# Altium project NESL_Underwater_Sensor_Tag.PrjPcb
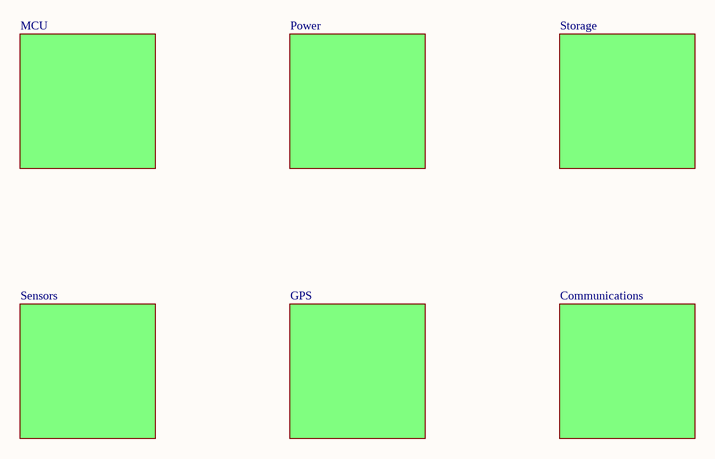
[diagram p0: Layout.SchDoc]
7 sheets, 67 parts. Net scope: flat (ports and power ports of the same name join across sheets).
Board file: PCB.PcbDoc
Sheets:
  Layout.SchDoc
    MCU = MCU.SchDoc
    Designator = Power.SchDoc
    Designator = Sensors.SchDoc
    Designator = Storage.SchDoc
    Designator = GPS.SchDoc
    Designator = Communications.SchDoc

## Sheet Layout.SchDoc
size A; SheetNumber: 1; SheetTotal: 6

### Sub-sheets
Designator = Power: no entries
Designator = Sensors: no entries
Designator = Storage: no entries
Designator = GPS: no entries
Designator = Communications: no entries
MCU = MCU: no entries

## Sheet MCU.SchDoc
size A; SheetNumber: 2; SheetTotal: 7
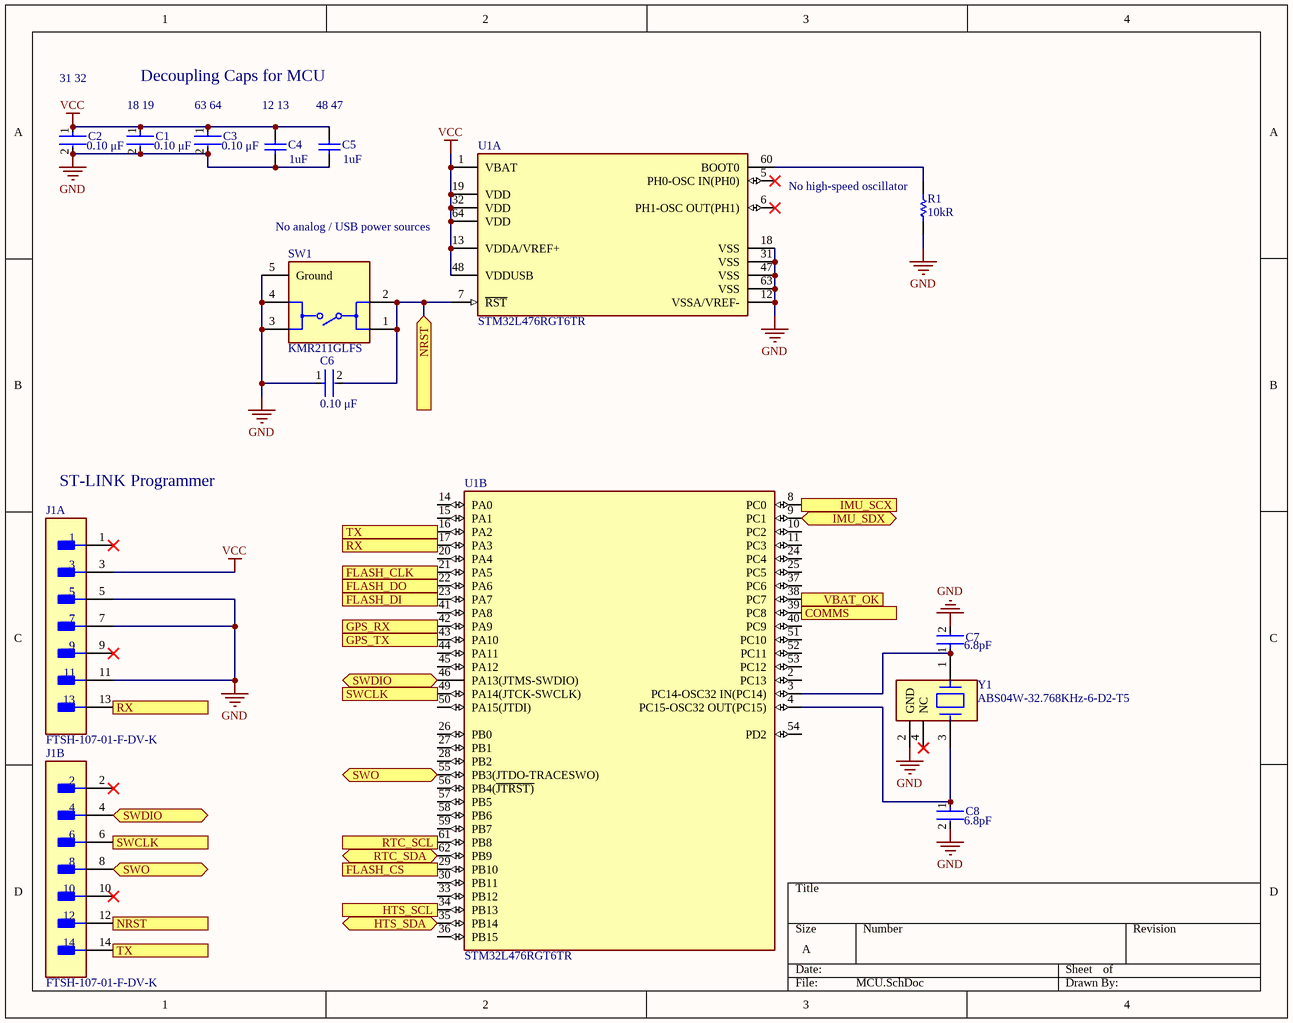
[diagram p1: MCU.SchDoc]

### Parts
C1  Capacitance: 0.10 μF  [FP-C0603C-CF-MFG]  (hidden comment: C0603C104K5RACTU)
C2  Capacitance: 0.10 μF  [FP-C0603C-CF-MFG]  (hidden comment: C0603C104K5RACTU)
C3  Capacitance: 0.10 μF  [FP-C0603C-CF-MFG]  (hidden comment: C0603C104K5RACTU)
C4  Capacitance: 1uF  [CAPC2013X135X45LL10T25]  (hidden comment: GRM21BR71H105KA12L)
C5  Capacitance: 1uF  [CAPC2013X135X45LL10T25]  (hidden comment: GRM21BR71H105KA12L)
C6  Capacitance: 0.10 μF  [FP-C0603C-CF-MFG]  (hidden comment: C0603C104K5RACTU)
C7  Capacitance: 6.8pF  [FP-0805-L_2_01_0_2-W_1_25-MFG]  (hidden comment: 08051A6R8CAT2A)
C8  Capacitance: 6.8pF  [FP-0805-L_2_01_0_2-W_1_25-MFG]  (hidden comment: 08051A6R8CAT2A)
J1  FTSH-107-01-F-DV-K  [FP-FTSH-107-01-F-DV-K-MFG]  (parts A,B of 2)
R1  Resistor: 10kR  [RESC2013X60X35NL10T20]  (hidden comment: RC0805FR-0710KL)
SW1  KMR211GLFS  [FP-KMR211GLFS-MFG]
U1  STM32L476RGT6TR  [FP-LQFP64-5W-MFG]  (parts A,B of 2)
Y1  ABS04W-32.768KHz-6-D2-T5  [FP-ABS04W-MFG]

### Ports
COMMS (out), FLASH_CLK (out), FLASH_CS (out), FLASH_DI (out), FLASH_DO (in), GPS_RX (out), GPS_TX (in), HTS_SCL (out), HTS_SDA (bidir), IMU_SCX (out), IMU_SDX (bidir), NRST (in), NRST (out), RTC_SCL (out), RTC_SDA (bidir), RX (in), RX (out), SWCLK (in), SWCLK (out), SWDIO (bidir), SWO (bidir), TX (in), TX (out), VBAT_OK

### Nets
GND: C1.2 C2.2 C3.2 C4.1 C5.1 C6.1 C7.2 C8.2 J1.5 J1.7 J1.11 R1.1 SW1.3 SW1.4 SW1.5(Ground) U1.12(VSSA/VREF-) U1.18(VSS) U1.31(VSS) U1.47(VSS) U1.63(VSS) Y1.2(GND)
VCC: C1.1 C2.1 C3.1 C4.2 C5.2 J1.3 U1.1(VBAT) U1.13(VDDA/VREF+) U1.19(VDD) U1.32(VDD) U1.48(VDDUSB) U1.64(VDD)
NetC6_2: C6.2 J1.12 SW1.1 SW1.2 U1.7(~{RST}) ; port NRST
NetC7_1: C7.1 U1.3(PC14-OSC32_IN(PC14)) Y1.1
NetC8_1: C8.1 U1.4(PC15-OSC32_OUT(PC15)) Y1.3
NetJ1_4: J1.4 U1.46(PA13(JTMS-SWDIO)) ; port SWDIO
NetJ1_6: J1.6 U1.49(PA14(JTCK-SWCLK)) ; port SWCLK
NetJ1_8: J1.8 U1.55(PB3(JTDO-TRACESWO)) ; port SWO
NetJ1_13: J1.13 U1.17(PA3) ; port RX
NetJ1_14: J1.14 U1.16(PA2) ; port TX
NetR1_2: R1.2 U1.60(BOOT0)
NetR2_1: U1.9(PC1) ; port IMU_SDX
NetR3_1: U1.34(PB13) ; port HTS_SCL
NetR4_1: U1.35(PB14) ; port HTS_SDA
NetR5_1: U1.8(PC0) ; port IMU_SCX
NetR6_1: U1.61(PB8) ; port RTC_SCL
NetR11_1: U1.39(PC8) ; port COMMS
NetU1_21: U1.21(PA5) ; port FLASH_CLK
NetU1_22: U1.22(PA6) ; port FLASH_DO
NetU1_23: U1.23(PA7) ; port FLASH_DI
NetU1_29: U1.29(PB10) ; port FLASH_CS
NetU1_38: U1.38(PC7) ; port VBAT_OK
NetU1_42: U1.42(PA9) ; port GPS_RX
NetU1_43: U1.43(PA10) ; port GPS_TX
NetU1_62: U1.62(PB9) ; port RTC_SDA

Not connected (* = marked no-connect by the designer): J1 1* 2* 9* 10*; U1 2(PC13) 5(PH0-OSC_IN(PH0))* 6(PH1-OSC_OUT(PH1))* 10(PC2) 11(PC3) 14(PA0) 15(PA1) 20(PA4) 24(PC4) 25(PC5) 26(PB0) 27(PB1) 28(PB2) 30(PB11) 33(PB12) 36(PB15) 37(PC6) 40(PC9) 41(PA8) 44(PA11) 45(PA12) 50(PA15(JTDI)) 51(PC10) 52(PC11) 53(PC12) 54(PD2) 56(PB4(~{JTRST)}) 57(PB5) 58(PB6) 59(PB7); Y1 4(NC)*

### Notes on the sheet
- 31 32
- Decoupling Caps for MCU
- (near C1) 18 19
- (near C3) 63 64
- (near C4) 12 13
- (near C5) 48 47
- No analog / USB power sources
- (near R1) No high-speed oscillator
- ST-LINK Programmer

### Library data of the parts
C1-C3 C6 = CMP-2006-03061-2: CAP CER 0.1UF 50V X7R 0603; Manufacturer: KEMET; Tolerance: 0.1; Temperature Coefficient: 30ppm/°C; Material: Ceramic; Automotive Grade: Grade 1; Value: 0.10 μF; Temperature: -55°C to +125°C; RoHS: TRUE; Temperature Range High: +125°C; Lead Free: Yes; Octopart: https://octopart.com/c0603c104k5ractu-kemet-139244; Digikey Description: CAP CER 0.1UF 50V X7R 0603; Category: Cap; Package: C0603C-CF; ComponentLink2Description: Datasheet; Temperature Range Low: -55°C; Device Class L1: Passive Components; Voltage Rating: 50 V; Automotive: Yes; Device Class L3: Ceramic Capacitors; ComponentLink2URL: https://api.kemet.com/component-edge/download/datasheet/C0603C100J5GACAUTO.pdf; Device Class L2: Capacitors; Manufacturer Part Number: C0603C104K5RACTU; Temperature Characteristic: X7R; Height: 0.87mm
C4 C5 = CMP-1036-04761-2: Manufacturer: Murata; Part Number: GRM21BR71H105KA12L
C7 C8 = CMP-1036-00709-3: General Purpose Ceramic Capacitor, 0805, 6.8pF, 0.25pF, C0G, 30ppm/°C, 100V; Dissipation Factor: 10%; Insulation Resistance: 100GR; Tolerance: 5%; Max Operating Temperature: 125°C; RoHS Compliant: Yes; Termination: SMD/SMT; Number of Pins: 2; Packaging: Tape and Reel; Mount: Surface Mount; Case Code (Metric): 2012; Case Code (Imperial): 0805; Height: 0.71mm; Min Operating Temperature: -55°C; Width: 0.049inch; Temperature Coefficient: 0ppm/°C; Length: 2.01mm; Dielectric: C0G; Series: -; Voltage Rating (DC): 100V; Dielectric Material: Ceramic; Depth: 1.25mm; Contact Plating: Tin; Voltage Rating: 100V; Thickness: 0.037inch; Case/Package: 0805; Lead Free: Lead Free; Radiation Hardening: No; Voltage: 100V; Construction: Flat; Package Quantity: 1; REACH SVHC: No SVHC
J1 = CMP-02766-001448-1: CONN HEADER SMD 14POS 1.27MM; Gender: Male; Connector Type: Male Pin; Number of Contacts: 14; Row Spacing: 0.05inch; Min Operating Temperature: -55°C; Package Quantity: 1; Lead Free: Lead Free; RoHS Compliant: Yes; Contact Material: Bronze; Contact Plating: Gold; Number of Rows: 2; Housing Material: Polymer; Contact Type: Male Pin; Series: FTSH; Max Operating Temperature: 125°C; Orientation: Straight; Number of Positions: 14; Pitch: 1.27mm; Housing Color: Black; Color: Black; Radiation Hardening: No; Length: 8.89mm; Termination: Solder; Packaging: Rail/Tube; Depth: 5.84mm; Mount: Surface Mount; Contact Mating Length: 0.12inch
R1 = CMP-1659-00013-4: Chip Resistor, 10 KOhm, +/- 1%, 0.125 W, -55 to 155 degC, 0805 (2012 Metric), RoHS, Tape and Reel; Manufacturer: Yageo; Voltage Rating: 150 V; Mount: Surface Mount; ComponentLink1Description: Manufacturer URL; ComponentLink2URL: http://www.yageo.com/documents/recent/PYu-RC_Group_51_RoHS_L_04.pdf; Pins: 2; Length: 2 mm; Min Operating Temperature: -55 degC; Height: 0.5 mm; Mounting Technology: Surface Mount; RoHSCompliant: true; REACH SVHC: No SVHC; ComponentLink1URL: http://www.yageo.com/; Max Operating Temperature: 155 degC; PackageReference: 0805; DatasheetVersion: Rev. 4, 02/2016; Package Quantity: 5000; Packaging: Tape and Reel; ComponentLink2Description: Datasheet; PackageDescription: 2-Pin Surface Mounted Device, Body 2 x 1.25 mm
SW1 = CMP-10040-000023-1: SWITCH TACTILE SPST-NO 0.05A 32V; Switch Function: Off-Mom; Throw Configuration: SPST; Switch Travel: 0.2mm; Current Rating: 50mA; Illumination Type: Non-Illuminated; Actuator Length: 0.5mm; Power Rating: 1W; Operating Force: 1.2N; Actuator Type: Standard; Mechanical Life: 200000Cycles; REACH SVHC: No SVHC; Voltage Rating (DC): 32V; Length: 2.8mm; Min Operating Temperature: -40°C; Mount: Surface Mount; Max Voltage Rating (DC): 32V; Width: 2.8mm; Depth: 4.6mm; Packaging: Tape and Reel; Lead Free: Lead Free; Contact Material: Silver; Termination: Gull Wing; Package Quantity: 1; Contact Current Rating: 50mA; Orientation: Straight; Max Operating Temperature: 85°C; Radiation Hardening: No; Max Current Rating: 50mA; Contact Plating: Silver
U1 = CMP-12105-000039-1: IC MCU 32BIT 1MB FLASH 64LQFP; Manufacturer: STMicroelectronics; Number Of Timers/Counters: 13; Number Of Spi Channels: 3; Number Of Pwm Channels: 28; Number Of Usb Channels: 1; Frequency: 80MHz; Data Bus Width: 32bits; Max Supply Voltage: 3.6V; Ram Size: 128KBytes; Memory Size: 1MBytes; Number Of Uart Channels: 6; Number Of Adc Channels: 16; Core Architecture: ARM Cortex-M4; Standoff Height: 0.05mm; Interface: I2C,SPI,UART,USART,CAN,USB,LIN,IrDA,SMBus,Other; Max Junction Temp: +105°C; Min Supply Voltage: 1.71V; Number Of I/Os: 51; Temperature Range Low: -40°C; Automotive: No; Ambient Temperature Range Low: -40°C; ComponentLink2URL: https://www.st.com/content/ccc/resource/technical/document/datasheet/c5/ed/2f/60/aa/79/42/0b/DM00108832.pdf/files/DM00108832.pdf/jcr:content/translations/en.DM00108832.pdf; Temperature: -40°C to +105°C; Device Class L1: Integrated Circuits (ICs); Package: LQFP64-5W; Category: IC; Memory Type: FLASH; Digikey Description: IC MCU 32BIT 1MB FLASH 64LQFP; Number Of A/D Converters: 3; Number Of I2C Channels: 3; Temperature Range High: +105°C; Lead Free: Yes; Number Of Cores: 1; Height: 1.6mm; Ambient Temperature Range High: +85°C; Device Class L2: Embedded Processors and Controllers; Octopart: https://octopart.com/stm32l476rgt6tr-stmicroelectronics-74146120; RoHS: TRUE; Ipc Land Pattern Name: QFP50P1200X1200X160-64; Mouser Description: MCU 32-Bit STM32 ARM Cortex M4 RISC 1MB Flash 1.8V/2.5V/3.3V 64-Pin LQFP T/R; ComponentLink2Description: Datasheet; Manufacturer Part Number: STM32L476RGT6TR; Device Class L3: Microcontrollers
Y1 = CMP-27762-001949-1: CRYSTAL 32.7680KHZ 4PF SMD; RoHS Compliant: Yes

## Sheet Power.SchDoc
size A; SheetNumber: 6; SheetTotal: 7
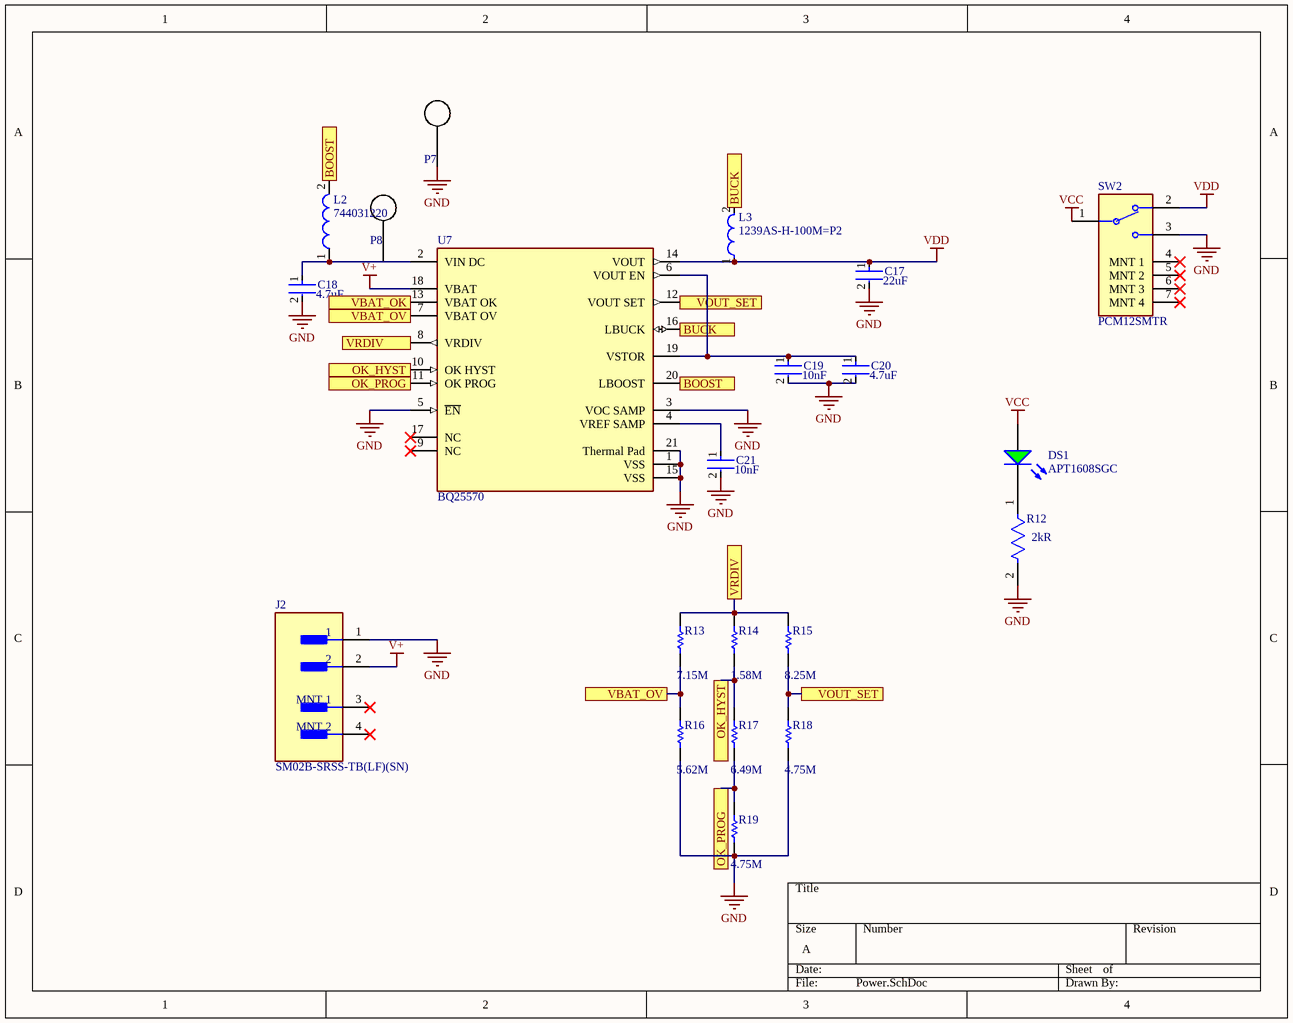
[diagram p2: Power.SchDoc]

### Parts
C17  Capacitance: 22uF  [FP-GRM21B-0_15-MFG]  (hidden comment: GRM21BR60J226ME39L)
C18  Capacitance: 4.7uF  [FP-C0603-CG-MFG]  (hidden comment: C0603C475K9PACTU)
C19  Capacitance: 10nF  [FP-C0805C-DN-MFG]  (hidden comment: C0805C103K2RACTU)
C20  Capacitance: 4.7uF  [FP-C0603-CG-MFG]  (hidden comment: C0603C475K9PACTU)
C21  Capacitance: 10nF  [FP-C0805C-DN-MFG]  (hidden comment: C0805C103K2RACTU)
DS1  APT1608SGC  [KING-APT1608SGC_V]
J2  SM02B-SRSS-TB(LF)(SN)  [FP-SM02B-SRSS-TB_LF_SN-0]
L2  744031220  [WE-TPC-3816-S]
L3  1239AS-H-100M=P2  [FP-DFE252012C-MFG]
P7  BlankPad  [BlankPad]  (value not drawn)
P8  BlankPad  [BlankPad]  (value not drawn)
R12  Resistance: 2kR  [FP-CRCW0805-e3-IPC_B]  (hidden comment: CRCW08052K00FKEA)
R13  Parameter 1: 7.15M  [RESC2013X50X30LL20T20]  (hidden comment: CRCW0805100RFKEA)
R14  Parameter 1: 1.58M  [RESC2013X50X30LL20T20]  (hidden comment: CRCW0805100RFKEA)
R15  Parameter 1: 8.25M  [RESC2013X50X30LL20T20]  (hidden comment: CRCW0805100RFKEA)
R16  Parameter 1: 5.62M  [RESC2013X50X30LL20T20]  (hidden comment: CRCW0805100RFKEA)
R17  Parameter 1: 6.49M  [RESC2013X50X30LL20T20]  (hidden comment: CRCW0805100RFKEA)
R18  Parameter 1: 4.75M  [RESC2013X50X30LL20T20]  (hidden comment: CRCW0805100RFKEA)
R19  Parameter 1: 4.75M  [RESC2013X50X30LL20T20]  (hidden comment: CRCW0805100RFKEA)
SW2  PCM12SMTR  [FP-PCM12SMTR-MFG]
U7  BQ25570  [FP-RGR0020A-MFG]

### Ports
BOOST, BUCK, OK_HYST, OK_PROG, VBAT_OK, VBAT_OV, VOUT_SET, VRDIV

### Nets
GND: C17.2 C18.2 C19.2 C20.2 C21.2 J2.1 R12.2 R16.1 R18.1 R19.1 SW2.3 U7.1(VSS) U7.3(VOC_SAMP) U7.5(~{EN}) U7.15(VSS) U7.21(Thermal_Pad)
V+: J2.2 U7.18(VBAT)
VCC: DS1.1(A) SW2.1
VDD: C17.1 L3.1 SW2.2 U7.14(VOUT)
NetC18_1: C18.1 L2.1 U7.2(VIN_DC)
NetC19_1: C19.1 C20.1 U7.6(VOUT_EN) U7.19(VSTOR)
NetC21_1: C21.1 U7.4(VREF_SAMP)
NetDS1_2: DS1.2(K) R12.1
NetL2_2: L2.2 U7.20(LBOOST) ; port BOOST
NetL3_2: L3.2 U7.16(LBUCK) ; port BUCK
NetR13_1: R13.1 R16.2 U7.7(VBAT_OV) ; port VBAT_OV
NetR13_2: R13.2 R14.2 R15.2 U7.8(VRDIV) ; port VRDIV
NetR14_1: R14.1 R17.2 U7.10(OK_HYST) ; port OK_HYST
NetR15_1: R15.1 R18.2 U7.12(VOUT_SET) ; port VOUT_SET
NetR17_1: R17.1 R19.2 U7.11(OK_PROG) ; port OK_PROG
NetU1_38: U7.13(VBAT_OK) ; port VBAT_OK

Not connected (* = marked no-connect by the designer): J2 3(MNT_1)* 4(MNT_2)*; P7 0; P8 0; SW2 4(MNT_1)* 5(MNT_2)* 6(MNT_3)* 7(MNT_4)*; U7 9(NC)* 17(NC)*

### Notes on the sheet
- Labels drawn without touching a wire or pin: GND

### Library data of the parts
C17 = CMP-2007-03385-2: Chip Multilayer Ceramic Capacitors for General Purpose, 0805, 22uF, X5R, 15%, 20%, 6.3V; Material: Ceramic; Max Operating Temperature: 85°C; Voltage: 6.3V; Min Operating Temperature: -55°C; Case/Package: 0805; Thickness: 0.053inch; Dielectric: X5R; Packaging: Tape and Reel; Depth: 1.25mm; Termination: SMD/SMT; Voltage Rating (DC): 6.3V; Radiation Hardening: No; Tolerance: 20%; Mount: Surface Mount; Lead Free: Lead Free; Package Quantity: 1; REACH SVHC: No SVHC; Voltage Rating: 6.3V; Length: 2mm; Case Code (Imperial): 0805; Case Code (Metric): 2012; Width: 0.049inch; Height: 1.25mm
C18 C20 = CMP-2006-02256-2: CAP CER 4.7UF 6.3V X5R 0603; Manufacturer: Kemet; Temperature Coefficient: 15%; Tolerance: 10%; Material: Ceramic; Device Class L3: Ceramic Capacitors; RoHS: TRUE; Value: 4.7uF; Lead Free: Yes; ComponentLink2Description: Datasheet; Mouser Description: Multilayer Ceramic Capacitors MLCC - SMD/SMT 6.3volts 4.7uF X5R 10%; Package: C0603-CG; Digikey Description: CAP CER 4.7UF 6.3V X5R 0603; ComponentLink2URL: https://content.kemet.com/datasheets/KEM_C1006_X5R_SMD.pdf; Category: Cap; Temperature Range Low: -55°C; Temperature: -55°C to +85°C; Octopart: https://octopart.com/c0603c475k9pactu-kemet-104242; Ipc Land Pattern Name: CAPC16080X80; Voltage Rating: 6.3V; Temperature Range High: +85°C; Height: 0.9mm; Temperature Characteristic: X5R; Device Class L1: Passive Components; Manufacturer Part Number: C0603C475K9PACTU; Automotive: No; Device Class L2: Capacitors
C19 C21 = CMP-2007-00259-2: CAP CER 10000PF 200V X7R 0805; Manufacturer: KEMET; Material: Ceramic; Temperature Coefficient: 30ppm/°C; Tolerance: 0.1; Value: 10,000 pF; Device Class L2: Capacitors; Voltage Rating: 200 V; Temperature Range High: +125°C; ComponentLink2Description: Datasheet; Height: 0.88mm; Octopart: https://octopart.com/c0805c103k2ractu-kemet-9138347; ComponentLink2URL: https://content.kemet.com/datasheets/KEM_C1003_C0G_SMD.pdf; Category: Cap; Temperature: -55°C to +125°C; Temperature Range Low: -55°C; Digikey Description: CAP CER 10000PF 200V X7R 0805; Manufacturer Part Number: C0805C103K2RACTU; Temperature Characteristic: X7R; Automotive: No; Device Class L3: Ceramic Capacitors; Mouser Description: KEMET - C0805C103K2RACTU - CAP, MLCC, X7R, 10NF, 200V, 0805; RoHS: TRUE; Device Class L1: Passive Components; Lead Free: Yes; Package: C0805C-DN; Ipc Land Pattern Name: CAPC200125X78
DS1 = CMP-2000-05789-1: Super Bright Green LED, 62.5 mW, 25 mA, -40 to 85 degC, 2-Pin SMD, RoHS, Tape and Reel; Manufacturer: Kingbright; Online Catalog: 0603RectanglewithFlatTopChipLEDs; Wavelength - Dominant: 568nm; Wavelength - Peak: 565nm; Voltage - Forward (Vf) (Typ): 2.2V; Lens Type: Clear; Other Names: 754-1121-2; Millicandela Rating: 15mcd; Catalog Drawings: APT1608SeriesTop / APT1608SeriesSide; Lens Style/Size: RectanglewithFlatTop,1.2mmx0.8mm; Current - Test: 20mA; 3D Model: APT1608x.sldprt / APT1608x.pro / APT1608x.igs / APT1608x.stp; Viewing Angle: 120°; Package / Case: 0603(1608Metric); Category: Optoelectronics; Package Description: 2-Pin Surface Mount Device, Body 0.8 x 1.6 mm; Mounting Type: SurfaceMount; Color: Green; Height: 0.75mm; Datasheet Version: Rev. 16B, 02/2012; Family: LEDIndication-Discrete; Manufacturer URL: http://www.kingbright.com/; Package Reference: APT1608SGC; Datasheet URL: https://datasheet.ciiva.com/2113/apt1608sgc-2113808.pdf; Mounting Technology: SurfaceMount; Packaging: Tape&Reel(TR); Standard Package: 2,000; Size / Dimension: 1.60mmLx0.80mmW
J2 = CMP-17439-000024-1: CONN HEADER SMD R/A 2POS 1MM; Current Rating: 700mA; Voltage Rating: 50V; Insulation Resistance: 100MR; Number of Contacts: 2; Contact Resistance: 40mR; Max Current Rating: 1A; Min Operating Temperature: -25°C; Housing Material: Polyamide; Flammability Rating: UL94 V-0; Lead Pitch: 1mm; REACH SVHC: No SVHC; Lead Free: Lead Free; Contact Finish - Mating: TIN; Packaging: Tape and Reel; Series: SR; Length: 4mm; Color: Natural; Housing Color: Beige; Number of Rows: 1; Insulation Color: Natural; Connector Type: Header; Contact Shape: Square; Depth: 4.95mm; Termination: Solder; Voltage Rating (AC): 50V; Max Operating Temperature: 85°C; Pitch: 1mm; Fastening Type: Pull; Number of Positions: 2; Contact Type: Male Pin; Material: Polyamide; Orientation: Right Angle; Mount: Surface Mount; Insulation Material: Nylon; Contact Plating: Copper; Max Voltage Rating (AC): 50V; Contact Material: Copper Alloy
L2 = CMP-0227-00346-1: SMD Shielded Tiny Power Inductor WE-TPC, L = 22.0 µH; Inductance: 22.0 ÂµH; ComponentLink1URL: http://www.we-online.com; PackageReference: WE-TPC-3816-S; ComponentLink1Description: Manufacturer Link; PackageVersion: 2009; ComponentLink2URL: http://www.we-online.de/katalog/media/pdf/744031220.pdf; PackageDescription: SMD Inductor, 2-Leads, Body 3.8 x 3.8 mm; ComponentLink2Description: Datasheet; DatasheetVersion: ver 6, Jan-2009
L3 = CMP-06042-012626-1: FIXED IND 10UH 1A 460 MOHM SMD; Shielding: Shielded; Core Material: Ferrite; DC Resistance (DCR): 460mR; Max DC Current: 850mA; Test Frequency: 1MHz; Tolerance: 20%; Mount: Surface Mount; Length: 0.098inch; Current Rating: 1A; Resistor Type: Wirewound; Packaging: Tape and Reel; Min Operating Temperature: -40°C; Width: 0.079inch; Max Operating Temperature: 85°C; Inductance: 10uH; Case Code (Metric): 2520; Depth: 2mm; Height - Seated (Max): 0.047inch; Case Code (Imperial): 1008; Case/Package: 1008
R12 = CMP-2001-03755-2: RES Thick Film, 2kΩ, 1%, 0.125W, 100ppm/°C, 0805; Working Voltage: 150V; Max Power Dissipation: 125mW; Package Quantity: 10; Case Code (Metric): 2012; Voltage Rating: 150V; Number of Terminations: 2; Max Operating Temperature: 155°C; Depth: 1.25mm; Tolerance: 1%; Power Rating: 125mW; Lead Free: Lead Free; Case/Package: 0805; Features: Automotive AEC-Q200; Min Operating Temperature: -55°C; Termination: SMD/SMT; Case Code (Imperial): 0805; Weight: 0.000194oz; Packaging: Tape and Reel; Military Standard: Not; Radiation Hardening: No; Contact Plating: Tin; Mount: Surface Mount; Temperature Coefficient: 100ppm/°C; Height: 0.02inch; Number of Terminals: 2; Voltage Rating (DC): 150V; Number of Pins: 2; Length: 2mm; Width: 1.25mm; Composition: Thick Film
R13-R19 = CMP-2001-04901-1: Manufacturer: Vishay Dale; Part Number: CRCW0805100RFKEA
SW2 = CMP-2000-06884-2: SWITCH SLIDE SPDT 300MA 6V; Actuator Material: Nylon; Switch Function: On-On; Insulation Resistance: 100mR; Actuator Type: Standard; Mechanical Life: 10000Cycles; Actuator Length: 1.5mm; Contact Resistance: 70mR; Min Operating Temperature: -20°C; Max Current Rating: 300mA; Max Voltage Rating (DC): 6V; Package Quantity: 1; Mount: Surface Mount; Packaging: Tape and Reel; Contact Plating: Silver; Depth: 5mm; REACH SVHC: No SVHC; Voltage Rating (DC): 6V; Voltage Rating (AC): 6V; Max Operating Temperature: 85°C; Length: 7.7mm; Termination: Gull Wing; Current Rating: 300mA; Contact Current Rating: 300mA; Orientation: Right Angle; Width: 6.7mm; Switch Travel: 1.5mm; Lead Free: Lead Free; Contact Material: Copper Alloy; Throw Configuration: SPDT
U7 = CMP-04911-000040-1: IC ENERGY HARV CTRLR BATT 20VQFN; Operating Supply Current: 488nA; Switching Frequency: 1MHz; Operating Supply Voltage: 4V; Output Current: 100mA; Packaging: Tape and Reel; Lead Free: Lead Free; Contact Plating: Gold; RoHS Compliant: Yes; Mount: Surface Mount; Case/Package: VQFN; Min Operating Temperature: -40°C; Max Operating Temperature: 125°C; Package Quantity: 3000; Number of Pins: 20

## Sheet Sensors.SchDoc
size A; SheetNumber: 3; SheetTotal: 7
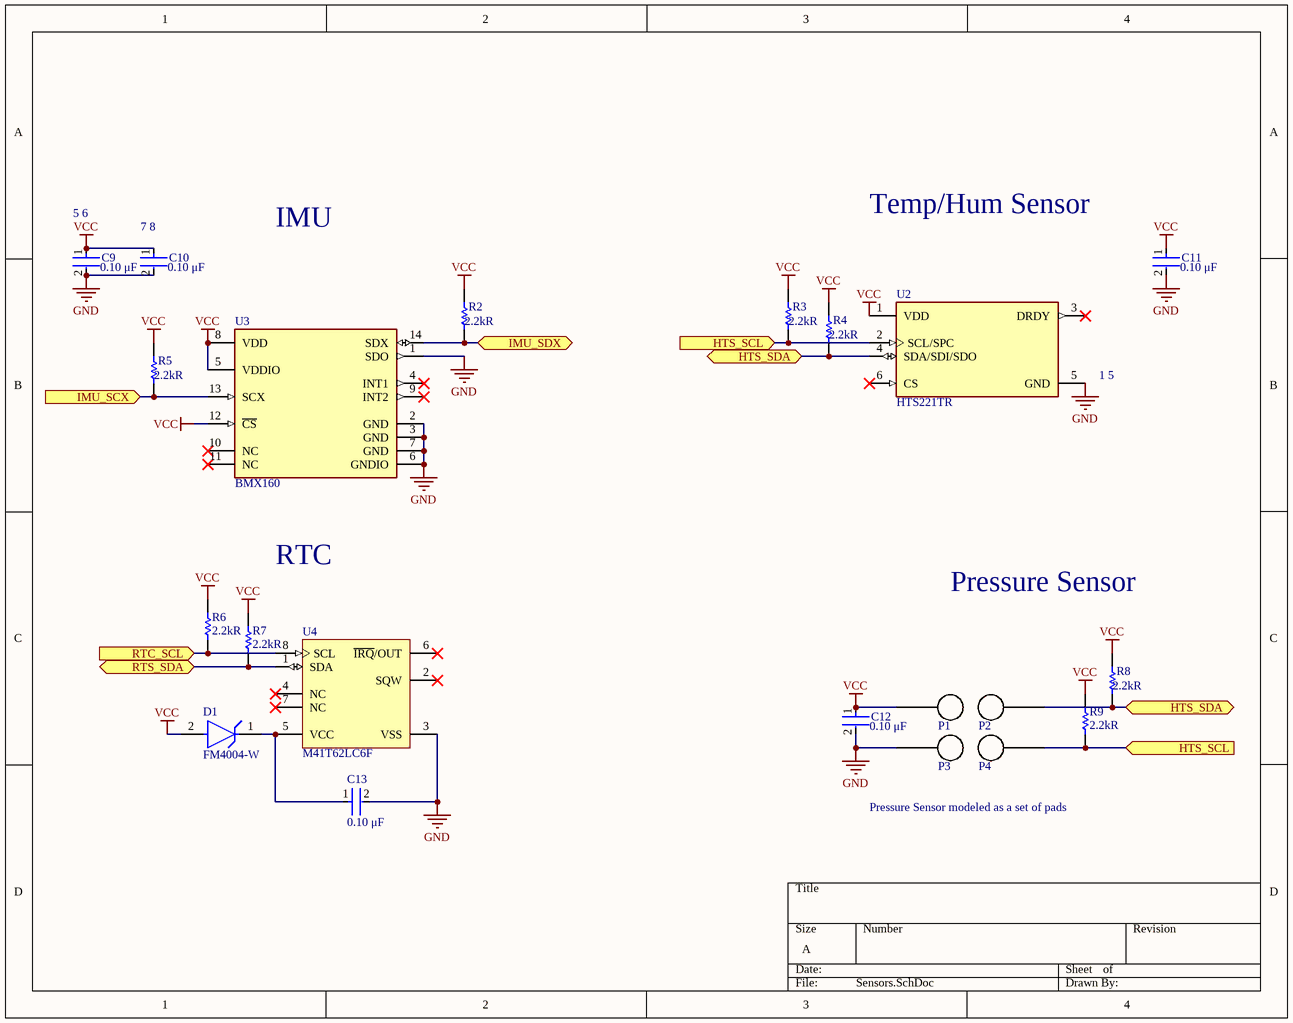
[diagram p3: Sensors.SchDoc]

### Parts
C9  Capacitance: 0.10 μF  [FP-C0603C-CF-MFG]  (hidden comment: C0603C104K5RACTU)
C10  Capacitance: 0.10 μF  [FP-C0603C-CF-MFG]  (hidden comment: C0603C104K5RACTU)
C11  Capacitance: 0.10 μF  [FP-C0603C-CF-MFG]  (hidden comment: C0603C104K5RACTU)
C12  Capacitance: 0.10 μF  [FP-C0603C-CF-MFG]  (hidden comment: C0603C104K5RACTU)
C13  Capacitance: 0.10 μF  [FP-C0603C-CF-MFG]  (hidden comment: C0603C104K5RACTU)
D1  FM4004-W  [FP-SMA-MFG]
P1  BlankPad  [BlankPad]  (value not drawn)
P2  BlankPad  [BlankPad]  (value not drawn)
P3  BlankPad  [BlankPad]  (value not drawn)
P4  BlankPad  [BlankPad]  (value not drawn)
R2  Resistance: 2.2kR  [RESC2013X60X40LL20T25]  (hidden comment: ERA6AEB222V)
R3  Resistance: 2.2kR  [RESC2013X60X40LL20T25]  (hidden comment: ERA6AEB222V)
R4  Resistance: 2.2kR  [RESC2013X60X40LL20T25]  (hidden comment: ERA6AEB222V)
R5  Resistance: 2.2kR  [RESC2013X60X40LL20T25]  (hidden comment: ERA6AEB222V)
R6  Resistance: 2.2kR  [RESC2013X60X40LL20T25]  (hidden comment: ERA6AEB222V)
R7  Resistance: 2.2kR  [RESC2013X60X40LL20T25]  (hidden comment: ERA6AEB222V)
R8  Resistance: 2.2kR  [RESC2013X60X40LL20T25]  (hidden comment: ERA6AEB222V)
R9  Resistance: 2.2kR  [RESC2013X60X40LL20T25]  (hidden comment: ERA6AEB222V)
U2  HTS221TR  [FP-HTS221TR-MFG]
U3  BMX160  [FP-BMX160-MFG]
U4  M41T62LC6F  [STM-LCC8_V]

### Ports
HTS_SCL (in), HTS_SDA (bidir), IMU_SCX (in), IMU_SDX (bidir), RTC_SCL (in), RTS_SDA (bidir)

### Nets
GND: C9.2 C10.2 C11.2 C12.2 C13.2 U2.5(GND) U3.1(SDO) U3.2(GND) U3.3(GND) U3.6(GNDIO) U3.7(GND) U4.3(VSS)
VCC: C9.1 C10.1 C11.1 C12.1 D1.2(A) R2.2 R3.2 R4.2 R5.2 R6.2 R7.2 R8.2 R9.2 U2.1(VDD) U3.5(VDDIO) U3.8(VDD) U3.12(~{CS})
NetC13_1: C13.1 D1.1(K) U4.5(VCC)
NetR2_1: R2.1 U3.14(SDX) ; port IMU_SDX
NetR3_1: R3.1 R9.1 U2.2(SCL/SPC) ; port HTS_SCL
NetR4_1: R4.1 R8.1 U2.4(SDA/SDI/SDO) ; port HTS_SDA
NetR5_1: R5.1 U3.13(SCX) ; port IMU_SCX
NetR6_1: R6.1 U4.8(SCL) ; port RTC_SCL
NetR7_1: R7.1 U4.1(SDA) ; port RTS_SDA

Not connected (* = marked no-connect by the designer): P1 0; P2 0; P3 0; P4 0; U2 3(DRDY)* 6(CS)*; U3 4(INT1)* 9(INT2)* 10(NC)* 11(NC)*; U4 2(SQW)* 4(NC)* 6(~{IRQ}/OUT)* 7(NC)*

### Notes on the sheet
- (near C9) 5 6
- (near C10) 7 8
- IMU
- Temp/Hum Sensor
- (near U2) 1 5
- RTC
- Pressure Sensor
- Pressure Sensor modeled as a set of pads

### Library data of the parts
C9-C13 = CMP-2006-03061-2: as C1 on sheet MCU; Temperature: -55°C to +125°C; RoHS: TRUE; Temperature Range High: +125°C; Lead Free: Yes; Octopart: https://octopart.com/c0603c104k5ractu-kemet-139244; Digikey Description: CAP CER 0.1UF 50V X7R 0603; Category: Cap; Package: C0603C-CF; ComponentLink2Description: Datasheet; Temperature Range Low: -55°C; Device Class L1: Passive Components; Voltage Rating: 50 V; Automotive: Yes; Device Class L3: Ceramic Capacitors; ComponentLink2URL: https://api.kemet.com/component-edge/download/datasheet/C0603C100J5GACAUTO.pdf; Device Class L2: Capacitors; Manufacturer Part Number: C0603C104K5RACTU; Temperature Characteristic: X7R; Height: 0.87mm
D1 = CMP-12225-000048-1: TVS DIODE 5V 13.4V SMA; Manufacturer Part Number: SMAJ5.0A-TR; Manufacturer: STMicroelectronics; Standoff Height: 0.05mm; Max Junction Temp: +150°C; Clamping Voltage: 9.2V; Number Of Channels: 1; Peak Pulse Power: 400W; Peak Pulse Current: 43.5A; Breakdown Voltage: 6.4V; Direction: Unidirectional; ComponentLink2Description: Datasheet; Lead Free: Yes; Package: SMA; Height: 2.65mm; Mouser Description: Transient Voltage Suppressor, TVS, Transil SMAJ Series, Unidirectional, 5 V, DO-214AC, 2, 6.4 V; Reverse Standoff Voltage: 5V; Temperature Range Low: -55°C; Device Class L1: Circuit Protection; RoHS: TRUE; Category: Diode; Automotive: No; ComponentLink2URL: https://www.st.com/resource/en/datasheet/smaj.pdf; Device Class L3: unset; Device Class L2: TVS Diodes; Temperature Range High: +150°C; Octopart: https://octopart.com/smaj5.0a-tr-stmicroelectronics-347063; Digikey Description: TVS DIODE 5V 13.4V SMA; Temperature: -55°C to +150°C
R2-R9 = CMP-2001-00613-1: Manufacturer: Panasonic; Part Number: ERA6AEB222V
U2 = CMP-2000-06428-2: SENS HUMI/TEMP 2.5V I2C 4.5% SMD; Resolution: 16b; Response Time: 10s; Operating Supply Voltage: 3.6V; Sensor Type: Temperature; Output Type: SPI; Accuracy: 4.5%; Lead Free: Lead Free; Radiation Hardening: No; Packaging: Tape and Reel; Max Operating Temperature: 120°C; Min Operating Temperature: -40°C; Interface: I2C; Mount: Surface Mount; Number of Pins: 6
U3 = CMP-191067-000010-2: IMU ACCEL/GYRO; Output Type: SPI; Sensor Type: Accelerometer; Number of Pins: 14; Max Operating Temperature: 85°C; Min Operating Temperature: -40°C; Case/Package: LGA; Mount: Surface Mount; Packaging: Tape and Reel
U4 = CMP-2000-06643-1: Low-Power Serial Real-Time Clock (RTC) with Alarm, 400 KHz, 1.3 to 4.4 V, -40 to 85 degC, 8-Pin LCC, RoHS, Tape and Reel; Manufacturer: STMicroelectronics; Interface: I²C,2-WireSerial; Current - Timekeeping (Max): 0.7µA~0.95µA@1.3V~4.4V; Other Related Documents: M41T62ViewAllSpecifications; Date Format: YY-MM-DD-dd; Voltage - Supply: 1.3V~4.4V; Online Catalog: SerialAddress; For Use With: 497-16464-ND / -EVALBOARDFORM41T62; Time Format: HH:MM:SS:hh(24hr); Other Names: 497-11275-1; Product Training Modules: SmartGridSolutions:SmartGridDistribution/SmartMeters; Standard Package: 1; Mounting Technology: SurfaceMount; Operating Temperature: -40°C~85°C; Features: Alarm,LeapYear,SquareWaveOutput,WatchdogTimer; Packaging: CutTape(CT); Family: Clock/Timing-RealTimeClocks; Package Description: 8-Pin Leadless Ceramic Chip Carrier, Body 3.2 x 1.5 mm, Pitch 0.9 mm; Mounting Type: SurfaceMount; Series: Timekeeper®; Manufacturer URL: http://www.st.com/; Datasheet URL: http://www.st.com/web/en/resource/technical/document/datasheet/CD00019860.pdf; Package Reference: LCC8; Package / Case: 8-LCC; Type: Clock/Calendar; Category: IntegratedCircuits(ICs); Datasheet Version: Rev. 22, 10/2015; Supplier Device Package: 8-LCC(1.5x3.2)

## Sheet Storage.SchDoc
size A; SheetNumber: 5; SheetTotal: 7
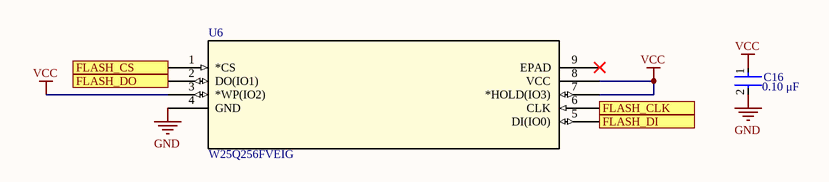
[diagram p4: Storage.SchDoc]

### Parts
C16  Capacitance: 0.10 μF  [FP-C0603C-CF-MFG]  (hidden comment: C0603C104K5RACTU)
U6  W25Q256FVEIG  [WIN_E-8_WIN]

### Ports
FLASH_CLK (in), FLASH_CS (in), FLASH_DI (in), FLASH_DO (out)

### Nets
GND: C16.2 U6.4(GND)
VCC: C16.1 U6.3(*WP(IO2)) U6.7(*HOLD(IO3)) U6.8(VCC)
NetU1_21: U6.6(CLK) ; port FLASH_CLK
NetU1_22: U6.2(DO(IO1)) ; port FLASH_DO
NetU1_23: U6.5(DI(IO0)) ; port FLASH_DI
NetU1_29: U6.1(*CS) ; port FLASH_CS

Not connected (* = marked no-connect by the designer): U6 9(EPAD)*

### Library data of the parts
C16 = CMP-2006-03061-2: as C1 on sheet MCU; Temperature: -55°C to +125°C; RoHS: TRUE; Temperature Range High: +125°C; Lead Free: Yes; Octopart: https://octopart.com/c0603c104k5ractu-kemet-139244; Digikey Description: CAP CER 0.1UF 50V X7R 0603; Category: Cap; Package: C0603C-CF; ComponentLink2Description: Datasheet; Temperature Range Low: -55°C; Device Class L1: Passive Components; Voltage Rating: 50 V; Automotive: Yes; Device Class L3: Ceramic Capacitors; ComponentLink2URL: https://api.kemet.com/component-edge/download/datasheet/C0603C100J5GACAUTO.pdf; Device Class L2: Capacitors; Manufacturer Part Number: C0603C104K5RACTU; Temperature Characteristic: X7R; Height: 0.87mm
U6 = W25Q256FVEIG: No Description Available; Mfr_Name: Winbond; Copyright: Copyright (C) 2022 Ultra Librarian. All rights reserved.; Manufacturer_Part_Number: W25Q256FVEIG; RefDes: RefDes; Type: DEV

## Sheet GPS.SchDoc
size A; SheetNumber: 4; SheetTotal: 7
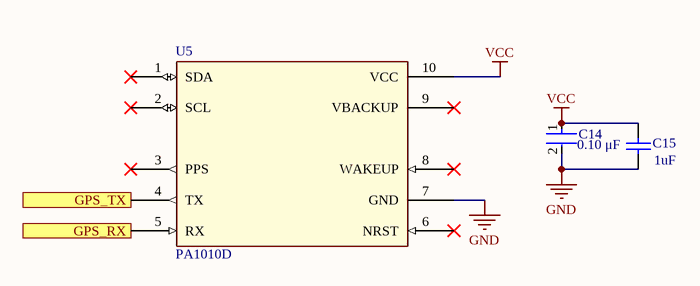
[diagram p5: GPS.SchDoc]

### Parts
C14  Capacitance: 0.10 μF  [FP-C0603C-CF-MFG]  (hidden comment: C0603C104K5RACTU)
C15  Capacitance: 1uF  [CAPC2013X135X45LL10T25]  (hidden comment: GRM21BR71H105KA12L)
U5  PA1010D  [PA1010D]

### Ports
GPS_RX (in), GPS_TX (out)

### Nets
GND: C14.2 C15.1 U5.7(GND)
VCC: C14.1 C15.2 U5.10(VCC)
NetU1_42: U5.5(RX) ; port GPS_RX
NetU1_43: U5.4(TX) ; port GPS_TX

Not connected (* = marked no-connect by the designer): U5 1(SDA)* 2(SCL)* 3(PPS)* 6(NRST)* 8(WAKEUP)* 9(VBACKUP)*

### Library data of the parts
C14 = CMP-2006-03061-2: as C1 on sheet MCU; Temperature: -55°C to +125°C; RoHS: TRUE; Temperature Range High: +125°C; Lead Free: Yes; Octopart: https://octopart.com/c0603c104k5ractu-kemet-139244; Digikey Description: CAP CER 0.1UF 50V X7R 0603; Category: Cap; Package: C0603C-CF; ComponentLink2Description: Datasheet; Temperature Range Low: -55°C; Device Class L1: Passive Components; Voltage Rating: 50 V; Automotive: Yes; Device Class L3: Ceramic Capacitors; ComponentLink2URL: https://api.kemet.com/component-edge/download/datasheet/C0603C100J5GACAUTO.pdf; Device Class L2: Capacitors; Manufacturer Part Number: C0603C104K5RACTU; Temperature Characteristic: X7R; Height: 0.87mm
C15 = CMP-1036-04761-2: Manufacturer: Murata; Part Number: GRM21BR71H105KA12L
U5 = PA1010D: Ultraminiature GPS Module 10x10x6.8mm

## Sheet Communications.SchDoc
size A; SheetNumber: 7; SheetTotal: 7
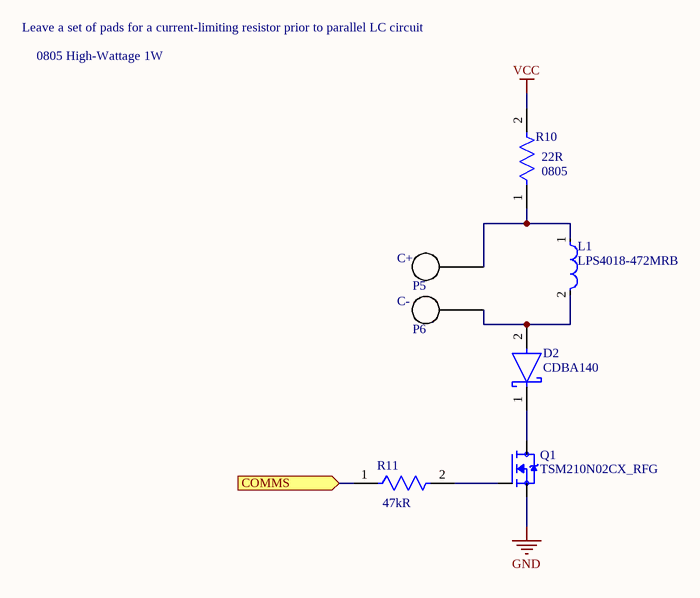
[diagram p6: Communications.SchDoc]

### Parts
D2  CDBA140  [FP-95400-MFG]
L1  LPS4018-472MRB  [FP-LPS4018-MFG]
P5  C+  [BlankPad]
P6  C-  [BlankPad]
Q1  TSM210N02CX_RFG  [TRANS_TSM210N02CX_RFG]
R10  Case/Package: 0805  Resistance: 22R  [FP-CRCW0805-e3-IPC_C]  (hidden comment: CRCW080522R0FKEA)
R11  Resistance: 47kR  [FP-CRCW0805-e3-MFG]  (hidden comment: CRCW080547K0FKEA)

### Ports
COMMS (in)

### Nets
GND: Q1.2(S)
VCC: R10.2
NetD2_1: D2.1(C) Q1.3(D)
NetD2_2: D2.2(A) L1.2
NetL1_1: L1.1 R10.1
NetQ1_1: Q1.1(G) R11.2
NetR11_1: R11.1 ; port COMMS

Not connected (* = marked no-connect by the designer): P5 0; P6 0

### Notes on the sheet
- Leave a set of pads for a current-limiting resistor prior to parallel LC circuit
- 0805 High-Wattage 1W

### Library data of the parts
D2 = CMP-02539-000001-1: DIODE SCHOTTKY 100V 1A SMA; Manufacturer: Vishay; Manufacturer Part Number: VS-10MQ100NTRPBF; Forward Current: 1.5A; Max Surge Forward Current: 30A; Standoff Height: 0mm; Value: 38pF; Max Junction Temp: +150°C; Peak Reverse Current: 0.1mA; Octopart: https://octopart.com/vs-10mq100ntrpbf-vishay-44340924; Max Repetitive Reverse Voltage: 100V; ComponentLink2Description: Datasheet; ComponentLink2URL: http://www.vishay.com/docs/94119/vs-10mq100ntrpbf.pdf; Reverse Voltage: 100V; Digikey Description: DIODE SCHOTTKY 100V 1A SMA; Mouser Description: DIODE SCHOTTKY 100V 1A SMA; Lead Free: Yes; Device Class L2: Diodes; Temperature Range Low: -55°C; Package: 95400; Height: 2.29mm; Capacitance: 38pF; Device Class L1: Discrete Semiconductors; Footprint Url: https://www.vishay.com/docs/95400/sma.pdf; Temperature: -55°C to +150°C; Temperature Range High: +150°C; RoHS: TRUE; Category: Diode; Device Class L3: Schottky Diodes; Automotive: No
L1 = CMP-11268-000004-1: Power inductor, shielded, 20/30% tol, SMT, RoHS, lead-free, halogen-free; Manufacturer Part Number: LPS4018-223MRB; Manufacturer: Coilcraft; Inductance: 22uH; Series Resistance: 0.36Ω; Test Frequency: 1MHz; Self Resonant Frequency: 26MHz; Tolerance: 20%; Core Material: Ferrite; Value: 22uH; Automotive Grade: Grade 3; Rms Current: 0.9A; Saturation Current: 0.8A; Shielding: true; RoHS: TRUE; Device Class L3: Fixed Inductors; Category: Ind; Lead Free: Yes; ComponentLink2URL: https://www.coilcraft.com/pdfs/lps4018.pdf; Height: 1.8mm; Mouser Description: Power inductor, shielded, 20/30% tol, SMT, RoHS, lead-free, halogen-free; Ambient Temperature Range High: +85°C; Ambient Temperature Range Low: -40°C; Device Class L2: Inductors; Package: LPS4018; Device Class L1: Passive Components; Octopart: https://octopart.com/lps4018-223mrb-coilcraft-30061092; ComponentLink2Description: Datasheet; Automotive: Yes
P5 P6 = BlankPad
Q1 = TSM210N02CX_RFG: N-Channel 20 V 6.7A (Tc) 1.56W (Tc) Surface Mount SOT-23; MF: Taiwan Semiconductor Corporation; MP: TSM210N02CX RFG; Purchase-URL: https://pricing.snapeda.com/search/part/TSM210N02CX RFG/?ref=eda; SnapEDA_Link: https://www.snapeda.com/parts/TSM210N02CX%20RFG/Taiwan+Semiconductor+Corporation/view-part/?ref=snap; Value: *; Package: SOT-23-3 Taiwan Semiconductor; Check_prices: https://www.snapeda.com/parts/TSM210N02CX%20RFG/Taiwan+Semiconductor+Corporation/view-part/?ref=eda; Price: None; Availability: In Stock
R10 = CMP-2001-03692-2: RES Thick Film, 22Ω, 1%, 0.125W, 100ppm/°C, 0805; Power Rating: 125mW; Voltage Rating: 150V; Radiation Hardening: No; Number of Terminations: 2; Termination: SMD/SMT; Package Quantity: 5000; Weight: 0.000194oz; Mount: Surface Mount; Lead Free: Lead Free; Height: 0.45mm; Composition: Thick Film; Min Operating Temperature: -55°C; Case Code (Metric): 2012; Temperature Coefficient: 100ppm/°C; Depth: 1.25mm; Packaging: Tape and Reel; Contact Plating: Tin; Width: 1.25mm; Case Code (Imperial): 0805; Length: 2mm; Max Operating Temperature: 155°C; Tolerance: 1%; Features: Automotive AEC-Q200; Military Standard: Not; Voltage Rating (DC): 150V; Max Power Dissipation: 125mW
R11 = CMP-2001-03939-2: RES Thick Film, 47kΩ, 1%, 0.125W, 100ppm/°C, 0805; Voltage Rating: 150V; Max Power Dissipation: 125mW; Termination: SMD/SMT; Case Code (Imperial): 0805; Number of Terminations: 2; Contact Plating: Tin; Min Operating Temperature: -55°C; Features: Automotive AEC-Q200; Temperature Coefficient: 100ppm/°C; Case/Package: 0805; Composition: Thick Film; Working Voltage: 150V; Width: 1.25mm; Package Quantity: 10; Lead Free: Lead Free; Radiation Hardening: No; Power Rating: 125mW; Military Standard: Not; Height: 0.45mm; Weight: 0.000194oz; Length: 2mm; Depth: 1.25mm; Voltage Rating (DC): 150V; Packaging: Tape and Reel; Case Code (Metric): 2012; Max Operating Temperature: 155°C; Tolerance: 1%

## Nets that join several sheets
GND: MCU (21 pins), Power (16 pins), Sensors (12 pins), Storage (C16.2 U6.4), GPS (C14.2 C15.1 U5.7), Communications (Q1.2)
VCC: MCU (12 pins), Power (DS1.1 SW2.1), Sensors (17 pins), Storage (C16.1 U6.3 U6.7 U6.8), GPS (C14.1 C15.2 U5.10), Communications (R10.2)
NetR2_1: MCU (U1.9), Sensors (R2.1 U3.14)
NetR3_1: MCU (U1.34), Sensors (R3.1 R9.1 U2.2)
NetR4_1: MCU (U1.35), Sensors (R4.1 R8.1 U2.4)
NetR5_1: MCU (U1.8), Sensors (R5.1 U3.13)
NetR6_1: MCU (U1.61), Sensors (R6.1 U4.8)
NetR11_1: MCU (U1.39), Communications (R11.1)
NetU1_21: MCU (U1.21), Storage (U6.6)
NetU1_22: MCU (U1.22), Storage (U6.2)
NetU1_23: MCU (U1.23), Storage (U6.5)
NetU1_29: MCU (U1.29), Storage (U6.1)
NetU1_38: MCU (U1.38), Power (U7.13)
NetU1_42: MCU (U1.42), GPS (U5.5)
NetU1_43: MCU (U1.43), GPS (U5.4)